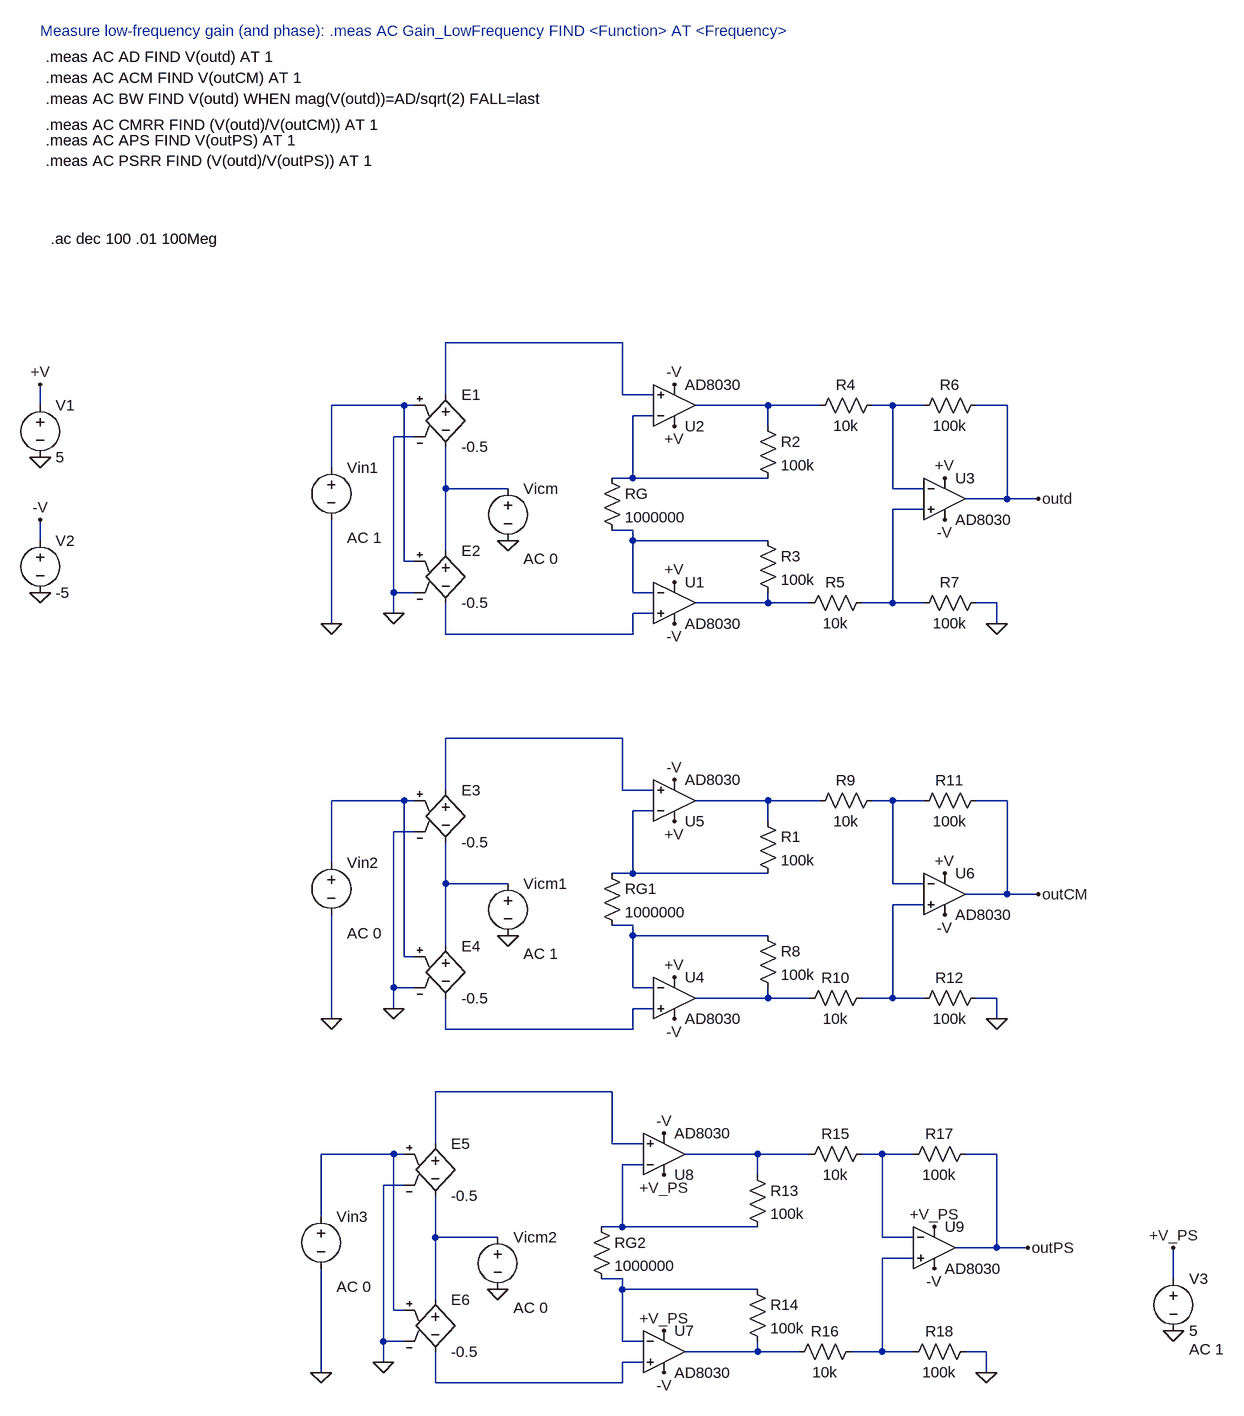
[diagram p0: schematic Stage1_AI_Ac.asc]
Stage1_AI_Ac.asc, the LTspice schematic file:
Version 4
SHEET 1 3144 1624
WIRE 960 -32 688 -32
WIRE 688 48 688 -32
WIRE 960 48 960 -32
WIRE 1008 48 960 48
WIRE 64 64 64 32
WIRE 624 64 512 64
WIRE 640 64 624 64
WIRE 1184 64 1072 64
WIRE 1264 64 1184 64
WIRE 1376 64 1344 64
WIRE 1424 64 1376 64
WIRE 1552 64 1504 64
WIRE 1008 80 976 80
WIRE 1184 96 1184 64
WIRE 640 112 608 112
WIRE 512 160 512 64
WIRE 976 176 976 80
WIRE 976 176 944 176
WIRE 1184 176 976 176
WIRE 688 192 688 128
WIRE 784 192 688 192
WIRE 1376 192 1376 64
WIRE 1424 192 1376 192
WIRE 1552 208 1552 64
WIRE 1552 208 1488 208
WIRE 1600 208 1552 208
WIRE 1424 224 1376 224
WIRE 976 256 944 256
WIRE 64 272 64 240
WIRE 976 272 976 256
WIRE 1184 272 976 272
WIRE 688 288 688 192
WIRE 624 304 624 64
WIRE 640 304 624 304
WIRE 608 352 608 112
WIRE 640 352 608 352
WIRE 976 352 976 272
WIRE 1008 352 976 352
WIRE 1184 368 1184 352
WIRE 1184 368 1072 368
WIRE 1248 368 1184 368
WIRE 1376 368 1376 224
WIRE 1376 368 1328 368
WIRE 1424 368 1376 368
WIRE 1536 368 1504 368
WIRE 608 384 608 352
WIRE 1008 384 976 384
WIRE 512 400 512 240
WIRE 1536 400 1536 368
WIRE 688 416 688 368
WIRE 976 416 976 384
WIRE 976 416 688 416
WIRE 960 576 688 576
WIRE 688 656 688 576
WIRE 960 656 960 576
WIRE 1008 656 960 656
WIRE 624 672 512 672
WIRE 640 672 624 672
WIRE 1184 672 1072 672
WIRE 1264 672 1184 672
WIRE 1376 672 1344 672
WIRE 1424 672 1376 672
WIRE 1552 672 1504 672
WIRE 1008 688 976 688
WIRE 1184 704 1184 672
WIRE 640 720 608 720
WIRE 512 768 512 672
WIRE 976 784 976 688
WIRE 976 784 944 784
WIRE 1184 784 976 784
WIRE 688 800 688 736
WIRE 784 800 688 800
WIRE 1376 800 1376 672
WIRE 1424 800 1376 800
WIRE 1552 816 1552 672
WIRE 1552 816 1488 816
WIRE 1600 816 1552 816
WIRE 1424 832 1376 832
WIRE 976 864 944 864
WIRE 976 880 976 864
WIRE 1184 880 976 880
WIRE 688 896 688 800
WIRE 624 912 624 672
WIRE 640 912 624 912
WIRE 608 960 608 720
WIRE 640 960 608 960
WIRE 976 960 976 880
WIRE 1008 960 976 960
WIRE 1184 976 1184 960
WIRE 1184 976 1072 976
WIRE 1248 976 1184 976
WIRE 1376 976 1376 832
WIRE 1376 976 1328 976
WIRE 1424 976 1376 976
WIRE 1536 976 1504 976
WIRE 608 992 608 960
WIRE 1008 992 976 992
WIRE 512 1008 512 848
WIRE 1536 1008 1536 976
WIRE 688 1024 688 976
WIRE 976 1024 976 992
WIRE 976 1024 688 1024
WIRE 944 1120 672 1120
WIRE 672 1200 672 1120
WIRE 944 1200 944 1120
WIRE 992 1200 944 1200
WIRE 608 1216 496 1216
WIRE 624 1216 608 1216
WIRE 1168 1216 1056 1216
WIRE 1248 1216 1168 1216
WIRE 1360 1216 1328 1216
WIRE 1408 1216 1360 1216
WIRE 1536 1216 1488 1216
WIRE 992 1232 960 1232
WIRE 1168 1248 1168 1216
WIRE 624 1264 592 1264
WIRE 496 1312 496 1216
WIRE 960 1328 960 1232
WIRE 960 1328 928 1328
WIRE 1168 1328 960 1328
WIRE 672 1344 672 1280
WIRE 768 1344 672 1344
WIRE 1360 1344 1360 1216
WIRE 1408 1344 1360 1344
WIRE 1536 1360 1536 1216
WIRE 1536 1360 1472 1360
WIRE 1584 1360 1536 1360
WIRE 1408 1376 1360 1376
WIRE 960 1408 928 1408
WIRE 1808 1408 1808 1360
WIRE 960 1424 960 1408
WIRE 1168 1424 960 1424
WIRE 672 1440 672 1344
WIRE 608 1456 608 1216
WIRE 624 1456 608 1456
WIRE 592 1504 592 1264
WIRE 624 1504 592 1504
WIRE 960 1504 960 1424
WIRE 992 1504 960 1504
WIRE 1168 1520 1168 1504
WIRE 1168 1520 1056 1520
WIRE 1232 1520 1168 1520
WIRE 1360 1520 1360 1376
WIRE 1360 1520 1312 1520
WIRE 1408 1520 1360 1520
WIRE 1520 1520 1488 1520
WIRE 592 1536 592 1504
WIRE 992 1536 960 1536
WIRE 496 1552 496 1392
WIRE 1520 1552 1520 1520
WIRE 672 1568 672 1520
WIRE 960 1568 960 1536
WIRE 960 1568 672 1568
FLAG 64 144 0
FLAG 64 352 0
FLAG 64 32 +V
FLAG 64 240 -V
FLAG 1040 400 -V
FLAG 1600 208 outd
FLAG 1536 400 0
FLAG 1456 176 +V
FLAG 608 384 0
FLAG 512 400 0
FLAG 1456 240 -V
FLAG 784 272 0
FLAG 1040 96 +V
FLAG 1040 336 +V
FLAG 1040 32 -V
FLAG 1040 1008 -V
FLAG 1600 816 outCM
FLAG 1536 1008 0
FLAG 1456 784 +V
FLAG 608 992 0
FLAG 512 1008 0
FLAG 1456 848 -V
FLAG 784 880 0
FLAG 1040 704 +V
FLAG 1040 944 +V
FLAG 1040 640 -V
FLAG 1024 1552 -V
FLAG 1584 1360 outPS
FLAG 1520 1552 0
FLAG 592 1536 0
FLAG 496 1552 0
FLAG 1440 1392 -V
FLAG 768 1424 0
FLAG 1024 1184 -V
FLAG 1808 1488 0
FLAG 1808 1360 +V_PS
FLAG 1024 1488 +V_PS
FLAG 1440 1328 +V_PS
FLAG 1024 1248 +V_PS
SYMBOL voltage 64 48 R0
WINDOW 123 0 0 Left 0
WINDOW 39 0 0 Left 0
SYMATTR InstName V1
SYMATTR Value 5
SYMBOL voltage 64 256 R0
WINDOW 123 0 0 Left 0
WINDOW 39 0 0 Left 0
SYMATTR InstName V2
SYMATTR Value -5
SYMBOL res 928 160 R0
SYMATTR InstName RG
SYMATTR Value 1000000
SYMBOL res 1168 80 R0
SYMATTR InstName R2
SYMATTR Value 100k
SYMBOL res 1168 256 R0
SYMATTR InstName R3
SYMATTR Value 100k
SYMBOL res 1360 48 R90
WINDOW 0 0 56 VBottom 2
WINDOW 3 32 56 VTop 2
SYMATTR InstName R4
SYMATTR Value 10k
SYMBOL res 1344 352 R90
WINDOW 0 0 56 VBottom 2
WINDOW 3 32 56 VTop 2
SYMATTR InstName R5
SYMATTR Value 10k
SYMBOL res 1520 48 R90
WINDOW 0 0 56 VBottom 2
WINDOW 3 32 56 VTop 2
SYMATTR InstName R6
SYMATTR Value 100k
SYMBOL res 1520 352 R90
WINDOW 0 0 56 VBottom 2
WINDOW 3 32 56 VTop 2
SYMATTR InstName R7
SYMATTR Value 100k
SYMBOL voltage 512 144 R0
WINDOW 123 24 124 Left 2
WINDOW 39 0 0 Left 0
WINDOW 3 24 44 Left 2
SYMATTR Value2 AC 1
SYMATTR Value ""
SYMATTR InstName Vin1
SYMBOL e 688 32 R0
SYMATTR InstName E1
SYMATTR Value -0.5
SYMBOL e 688 272 R0
SYMATTR InstName E2
SYMATTR Value -0.5
SYMBOL voltage 784 176 R0
WINDOW 123 24 124 Left 2
WINDOW 39 0 0 Left 0
SYMATTR Value2 AC 0
SYMATTR InstName Vicm
SYMATTR Value ""
SYMBOL OpAmps\\AD8030 1040 304 R0
SYMATTR InstName U1
SYMBOL OpAmps\\AD8030 1040 128 M180
SYMATTR InstName U2
SYMBOL OpAmps\\AD8030 1456 144 R0
SYMATTR InstName U3
SYMBOL res 928 768 R0
SYMATTR InstName RG1
SYMATTR Value 1000000
SYMBOL res 1168 688 R0
SYMATTR InstName R1
SYMATTR Value 100k
SYMBOL res 1168 864 R0
SYMATTR InstName R8
SYMATTR Value 100k
SYMBOL res 1360 656 R90
WINDOW 0 0 56 VBottom 2
WINDOW 3 32 56 VTop 2
SYMATTR InstName R9
SYMATTR Value 10k
SYMBOL res 1344 960 R90
WINDOW 0 0 56 VBottom 2
WINDOW 3 32 56 VTop 2
SYMATTR InstName R10
SYMATTR Value 10k
SYMBOL res 1520 656 R90
WINDOW 0 0 56 VBottom 2
WINDOW 3 32 56 VTop 2
SYMATTR InstName R11
SYMATTR Value 100k
SYMBOL res 1520 960 R90
WINDOW 0 0 56 VBottom 2
WINDOW 3 32 56 VTop 2
SYMATTR InstName R12
SYMATTR Value 100k
SYMBOL voltage 512 752 R0
WINDOW 123 24 124 Left 2
WINDOW 39 0 0 Left 0
WINDOW 3 24 44 Left 2
SYMATTR Value2 AC 0
SYMATTR Value ""
SYMATTR InstName Vin2
SYMBOL e 688 640 R0
SYMATTR InstName E3
SYMATTR Value -0.5
SYMBOL e 688 880 R0
SYMATTR InstName E4
SYMATTR Value -0.5
SYMBOL voltage 784 784 R0
WINDOW 123 24 124 Left 2
WINDOW 39 0 0 Left 0
SYMATTR Value2 AC 1
SYMATTR InstName Vicm1
SYMATTR Value ""
SYMBOL OpAmps\\AD8030 1040 912 R0
SYMATTR InstName U4
SYMBOL OpAmps\\AD8030 1040 736 M180
SYMATTR InstName U5
SYMBOL OpAmps\\AD8030 1456 752 R0
SYMATTR InstName U6
SYMBOL res 912 1312 R0
SYMATTR InstName RG2
SYMATTR Value 1000000
SYMBOL res 1152 1232 R0
SYMATTR InstName R13
SYMATTR Value 100k
SYMBOL res 1152 1408 R0
SYMATTR InstName R14
SYMATTR Value 100k
SYMBOL res 1344 1200 R90
WINDOW 0 0 56 VBottom 2
WINDOW 3 32 56 VTop 2
SYMATTR InstName R15
SYMATTR Value 10k
SYMBOL res 1328 1504 R90
WINDOW 0 0 56 VBottom 2
WINDOW 3 32 56 VTop 2
SYMATTR InstName R16
SYMATTR Value 10k
SYMBOL res 1504 1200 R90
WINDOW 0 0 56 VBottom 2
WINDOW 3 32 56 VTop 2
SYMATTR InstName R17
SYMATTR Value 100k
SYMBOL res 1504 1504 R90
WINDOW 0 0 56 VBottom 2
WINDOW 3 32 56 VTop 2
SYMATTR InstName R18
SYMATTR Value 100k
SYMBOL voltage 496 1296 R0
WINDOW 123 24 124 Left 2
WINDOW 39 0 0 Left 0
WINDOW 3 24 44 Left 2
SYMATTR Value2 AC 0
SYMATTR Value ""
SYMATTR InstName Vin3
SYMBOL e 672 1184 R0
SYMATTR InstName E5
SYMATTR Value -0.5
SYMBOL e 672 1424 R0
SYMATTR InstName E6
SYMATTR Value -0.5
SYMBOL voltage 768 1328 R0
WINDOW 123 24 124 Left 2
WINDOW 39 0 0 Left 0
SYMATTR Value2 AC 0
SYMATTR InstName Vicm2
SYMATTR Value ""
SYMBOL OpAmps\\AD8030 1024 1456 R0
SYMATTR InstName U7
SYMBOL OpAmps\\AD8030 1024 1280 M180
SYMATTR InstName U8
SYMBOL OpAmps\\AD8030 1440 1296 R0
SYMATTR InstName U9
SYMBOL voltage 1808 1392 R0
WINDOW 123 24 124 Left 2
WINDOW 39 0 0 Left 0
SYMATTR Value2 AC 1
SYMATTR InstName V3
SYMATTR Value 5
TEXT 80 -192 Left 2 !.ac dec 100 .01 100Meg
TEXT 64 -512 Left 2 ;Measure low-frequency gain (and phase): .meas AC Gain_LowFrequency FIND <Function> AT <Frequency>
TEXT 72 -472 Left 2 !.meas AC AD FIND V(outd) AT 1
TEXT 72 -440 Left 2 !.meas AC ACM FIND V(outCM) AT 1
TEXT 72 -408 Left 2 !.meas AC BW FIND V(outd) WHEN mag(V(outd))=AD/sqrt(2) FALL=last
TEXT 72 -368 Left 2 !.meas AC CMRR FIND (V(outd)/V(outCM)) AT 1
TEXT 72 -344 Left 2 !.meas AC APS FIND V(outPS) AT 1
TEXT 72 -312 Left 2 !.meas AC PSRR FIND (V(outd)/V(outPS)) AT 1

The netlist it stands for:
* Stage1_AI_Ac.asc
V1 +V 0 5
V2 -V 0 -5
RG N005 N008 1000000
R2 N003 N005 100k
R3 N008 N009 100k
R4 N004 N003 10k
R5 N007 N009 10k
R6 outd N004 100k
R7 0 N007 100k
Vin1 N002 0 AC 1
E1 N001 N006 N002 0 -0.5
E2 N006 N010 N002 0 -0.5
Vicm N006 0 AC 0
XU1 N010 N008 +V -V N009 AD8040  ; AD8030, pins In+ In- V+ V- OUT
XU2 N001 N005 +V -V N003 AD8040  ; AD8030, pins In+ In- V+ V- OUT
XU3 N007 N004 +V -V outd AD8040  ; AD8030, pins In+ In- V+ V- OUT
RG1 N015 N018 1000000
R1 N013 N015 100k
R8 N018 N019 100k
R9 N014 N013 10k
R10 N017 N019 10k
R11 outCM N014 100k
R12 0 N017 100k
Vin2 N012 0 AC 0
E3 N011 N016 N012 0 -0.5
E4 N016 N020 N012 0 -0.5
Vicm1 N016 0 AC 1
XU4 N020 N018 +V -V N019 AD8040  ; AD8030, pins In+ In- V+ V- OUT
XU5 N011 N015 +V -V N013 AD8040  ; AD8030, pins In+ In- V+ V- OUT
XU6 N017 N014 +V -V outCM AD8040  ; AD8030, pins In+ In- V+ V- OUT
RG2 N025 N028 1000000
R13 N023 N025 100k
R14 N028 N029 100k
R15 N024 N023 10k
R16 N027 N029 10k
R17 outPS N024 100k
R18 0 N027 100k
Vin3 N022 0 AC 0
E5 N021 N026 N022 0 -0.5
E6 N026 N030 N022 0 -0.5
Vicm2 N026 0 AC 0
XU7 N030 N028 +V_PS -V N029 AD8040  ; AD8030, pins In+ In- V+ V- OUT
XU8 N021 N025 +V_PS -V N023 AD8040  ; AD8030, pins In+ In- V+ V- OUT
XU9 N027 N024 +V_PS -V outPS AD8040  ; AD8030, pins In+ In- V+ V- OUT
V3 +V_PS 0 5 AC 1
.ac dec 100 .01 100Meg
* Measure low-frequency gain (and phase): .meas AC Gain_LowFrequency FIND <Function> AT <Frequency>
.meas AC AD FIND V(outd) AT 1
.meas AC ACM FIND V(outCM) AT 1
.meas AC BW FIND V(outd) WHEN mag(V(outd))=AD/sqrt(2) FALL=last
.meas AC CMRR FIND (V(outd)/V(outCM)) AT 1
.meas AC APS FIND V(outPS) AT 1
.meas AC PSRR FIND (V(outd)/V(outPS)) AT 1
.lib ADI.lib
.backanno
.end